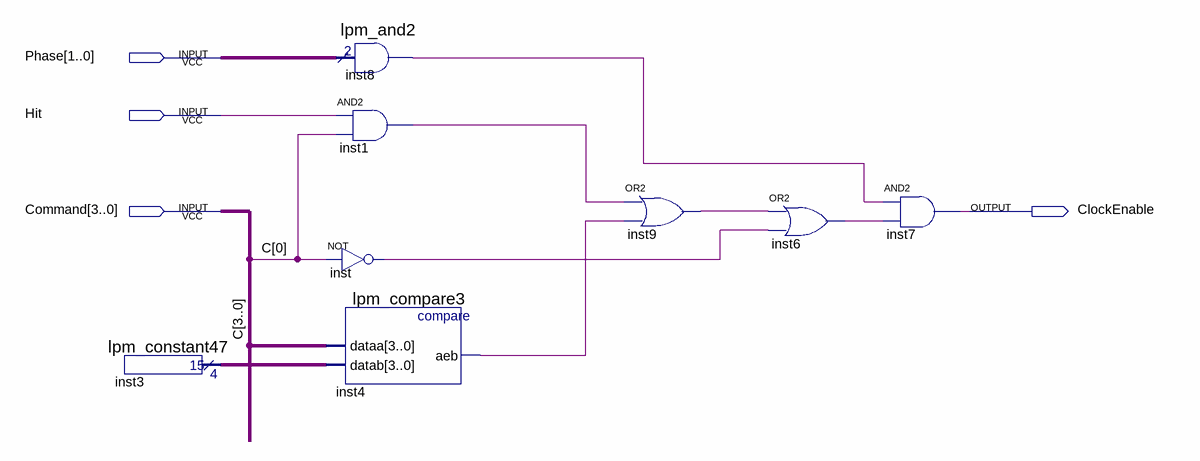
[diagram p0: schematic sheet]
// Quartus schematic ClockEnableForLoadFromRam.bdf as structural Verilog: 8 symbols, 4 pins
module ClockEnableForLoadFromRam (
  input  [1:0] Phase,
  input  Hit,
  input  [3:0] Command,
  output ClockEnable
);

  wire inst1_out, inst4_aeb, inst6_out, inst8_result, inst9_out, inst_out;
  wire [3:0] inst3_result;

  lpm_constant47 inst3 (.result(inst3_result));
  lpm_and2 inst8 (.data(Phase), .result(inst8_result));
  and inst1 (inst1_out, Hit, Command[0]);
  not inst (inst_out, Command[0]);
  lpm_compare3 inst4 (.dataa(Command), .datab(inst3_result), .aeb(inst4_aeb));
  or inst9 (inst9_out, inst1_out, inst4_aeb);
  or inst6 (inst6_out, inst9_out, inst_out);
  and inst7 (ClockEnable, inst8_result, inst6_out);

  // Other names for the same wires on the sheet: C[3:0] = Command
endmodule
